# Altium schematic sheet GSM.SchDoc: GSM
size A4; SheetNumber: 1; SheetTotal: 1
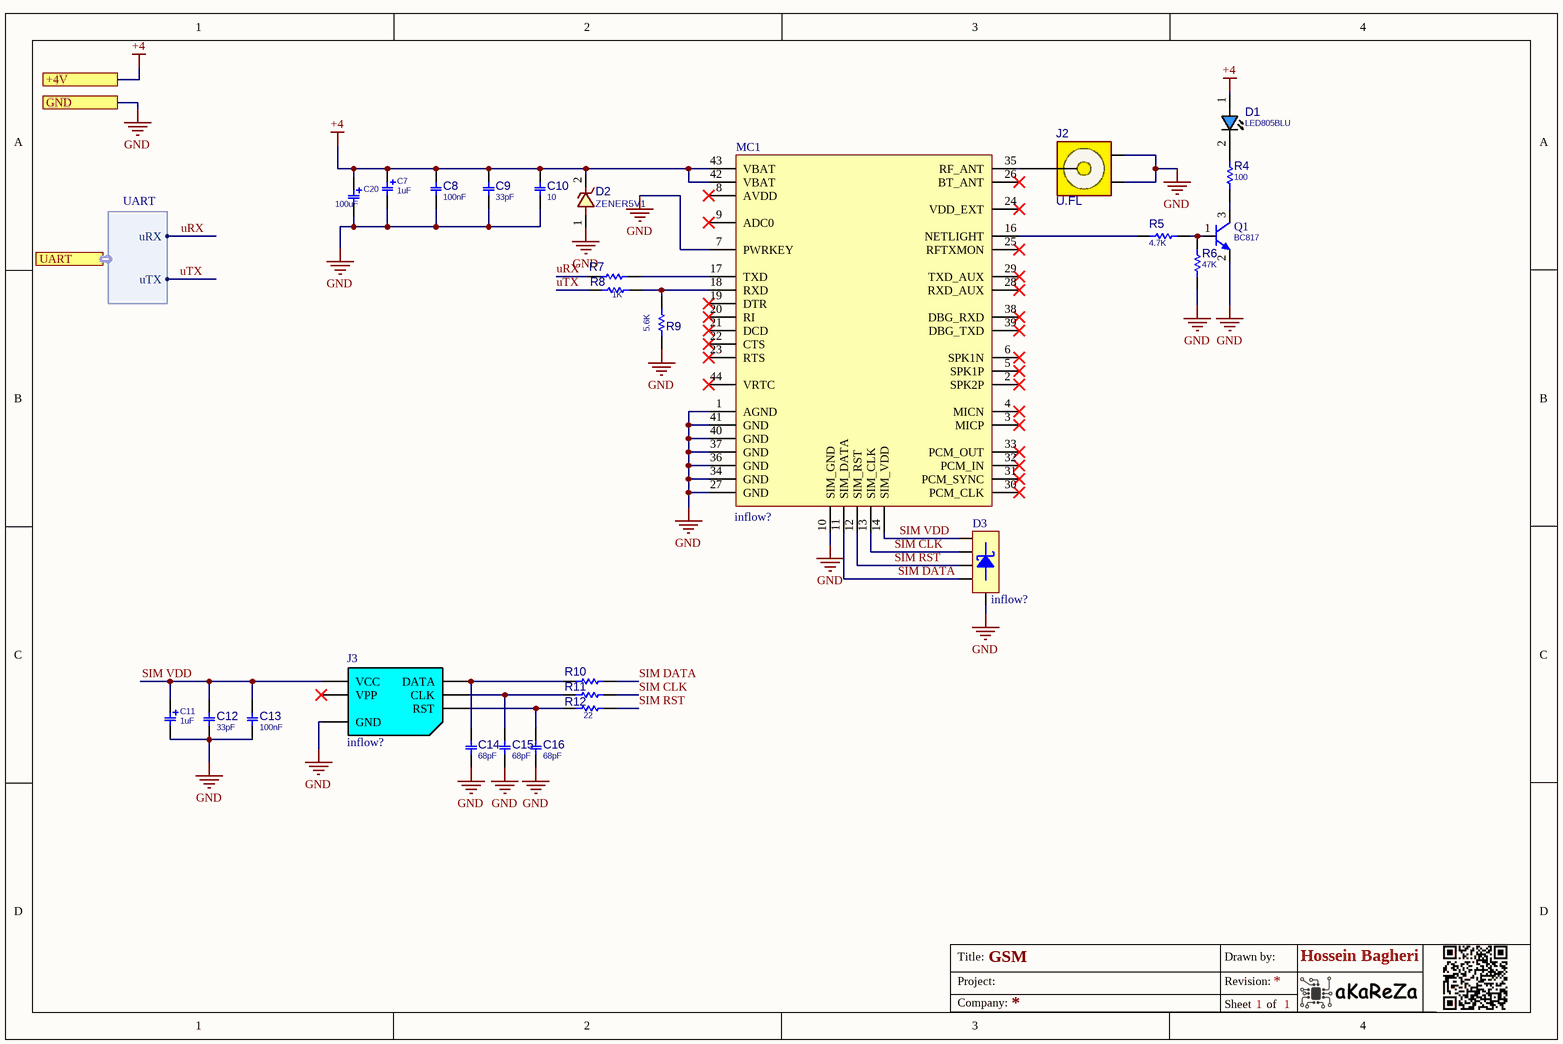
[diagram p0: GSM.SchDoc]

## Parts
C7  1uF  [C_TN_2012]
C8  100nF  [C0805]
C9  33pF  [C0805]
C10  10  [C0805]
C11  1uF  [C_TN_2012]
C12  33pF  [C0805]
C13  100nF  [C0805]
C14  68pF  [C0805]
C15  68pF  [C0805]
C16  68pF  [C0805]
C20  100uF  [C_TN_3528]
D1  LED805BLU  [LED0805BLU]
D2  ZENER5V1  [D_SOD123W]
D3  Inflow: inflow?  [SC70-5_N]  (hidden comment: SMF-05)
J2  U.FL  [UFL]
J3  Inflow: inflow?  [GCT_SIM8051]  (hidden comment: 6'Pin)
MC1  Inflow: inflow?  [m66]  (hidden comment: M66)
Q1  BC817  [SOT23_3]
R4  100  [R0805]
R5  4.7K  [R0805]
R6  47K  [R0805]
R7  1K  [R0805]
R8  22  [R0805]  (value not drawn)
R9  5.6K  [R0805]
R10  22  [R0805]  (value not drawn)
R11  22  [R0805]  (value not drawn)
R12  22  [R0805]

## Ports
+4V, GND, UART (harness UART)

## Harnesses
UART: uRX, uTX

## Nets
+4: C7.1 C8.2 C9.2 C10.2 C20.1 D1.1(ANODE) D2.2 MC1.42(VBAT) MC1.43(VBAT) ; port +4V
GND: C7.2 C8.1 C9.1 C10.1 C11.2 C12.1 C13.1 C14.1 C15.1 C16.1 C20.2 D2.1 D3.2(K) J2.2(G1) J2.3(G2) J3.5(GND) MC1.1(AGND) MC1.7(PWRKEY) MC1.10(SIM_GND) MC1.27(GND) MC1.34(GND) MC1.36(GND) MC1.37(GND) MC1.40(GND) MC1.41(GND) Q1.2(E) R6.1 R9.2 ; port GND
SIM CLK: D3.4(K) MC1.13(SIM_CLK) R11.1
SIM DATA: D3.5(K) MC1.11(SIM_DATA) R10.1
SIM RST: D3.1(K) MC1.12(SIM_RST) R12.1
SIM VDD: C11.1 C12.2 C13.2 D3.3(K) J3.1(VCC) MC1.14(SIM_VDD)
uRX: R7.2 ; port UART.uRX
uTX: R8.2 ; port UART.uTX
NetC14_2: C14.2 J3.4(DATA) R10.2
NetC15_2: C15.2 J3.3(CLK) R11.2
NetC16_2: C16.2 J3.2(RST) R12.2
NetD1_2: D1.2(CATHODE) R4.2
NetJ2_1: J2.1(SIG) MC1.35(RF_ANT)
NetMC1_16: MC1.16(NETLIGHT) R5.2
NetMC1_17: MC1.17(TXD) R7.1
NetMC1_18: MC1.18(RXD) R8.1 R9.1
NetQ1_1: Q1.1(B) R5.1 R6.2
NetQ1_3: Q1.3(C) R4.1

Not connected (* = marked no-connect by the designer): J3 6(VPP)*; MC1 2(SPK2P)* 3(MICP)* 4(MICN)* 5(SPK1P)* 6(SPK1N)* 8(AVDD)* 9(ADC0)* 19(DTR)* 20(RI)* 21(DCD)* 22(CTS)* 23(RTS)* 24(VDD_EXT)* 25(RFTXMON)* 26(BT_ANT)* 28(RXD_AUX)* 29(TXD_AUX)* 30(PCM_CLK)* 31(PCM_SYNC)* 32(PCM_IN)* 33(PCM_OUT)* 38(DBG_RXD)* 39(DBG_TXD)* 44(VRTC)*

## Notes on the sheet
- Title:
- Project:
- Drawn by:
- Revision:
- Hossein Bagheri
- Company:
- Sheet
- of

## Library data of the parts
C7 C11 = CAP_SMD_TAN: CAP, SMD, TAN,; PARAM2: 6.3V; VALUE: 1uF
C8-C10 C12-C16 = CAP_SMD_MLCC_2.2u50V_0805: CAP, MLCC; MANF_P#: UMK212ABJ225KG-T; MANF: Taiyo Yuden; PARAM: X5R, 10%; DIST#: MOUSER; PARAM2: 50V; ASSEMBLY: ASSEMBLY; PRICE: 100= 10$; DESC: CAP, MLCC
  C8 C13: VALUE: 100nF
  C9 C12: VALUE: 33pF
  C10: VALUE: 10
  C14-C16: VALUE: 68pF
C20 = CAP_SMD_TAN_10uF_16V: CAP, SMD, TAN; PARAM: 20%, 200mOhm, -55~105oC; MANF: AVX; MANF_P#: TCJT106M016R0200; PARAM2: 25V; PRICE: 1$; VALUE: 100uF
D1 = LED_SMD_0805_BLU: LED, SMD, 0805, BLUE; DESC: DESCRIPTION; MANF_P#: MANF_PART#; PARAM2: 2.2V; MANF: MANF; ASSEMBLY: ASSEMBLY; PRICE: 36t@Javan; VALUE: LED805BLU
D2 = DIODE_SMD_ZENER_BZT52HC5V1: DIODE, ZENER, 1W, 5.1V; MANF: Diodes; DESC: DESCRIPTION; PARAM2: 1W, 4Ohm, -55~150oC; MANF_P#: BZT52HC5V1WF-7; ASSEMBLY: ASSEMBLY; PRICE: 0.25$; PARAM: 5.1V; VALUE: ZENER5V1
D3 = Semi_Diod_TVS_SMF05: TVS Diode Array; Rating: Rating?; Validation: Valid; Type: TVS; Value: SMF-05; Package: SC70-5
J2 = CONN_RF_UFL: CONN, RF, U.FL, STRAIGHT, Ultra Miniature Coaxial; MANF_P#: CONUFL001-SMD, U.FL-R-SMT-1(10), 128-0711-201; MANF: Linx, Hirose, Cinch; PARAM: 50Ohm, 6GHz; DESC: DESCRIPTION; DIST#: DIGIKEY, MOUSER; PARAM2: GOLD; ASSEMBLY: ASSEMBLY; PRICE: 0.9$; VALUE: U.FL
J3 = Con_Socket_SimCard_1: Nano SimCard Holder 6P; Rating: Rating?; Validation: Valid; Package: SMD; Type: Nano; Value: 6'Pin
MC1 = ModSen_Com_M66: Quectel GSM/GPRS Module; Rating: Rating?; Validation: Valid; Package: Dip; Value: M66; Type: GSM-GPRS
Q1 = NPN_BC817_SOT23: BJT, NPN, 45v, 0.5A, SMD, SOT23; PARAM: 0.5A, Hfe100~600; PARAM2: 45v, 250mW; MANF: NXP, ON; MANF_P#: BC817; VALUE: BC817
R4-R12 = RES_SMD_0805: RESISTOR, SMD; PARAM: -W; DESC: DESCRIPTION; DIST#: MOUSER; PARAM2: 1%; MANF_P#: -; MANF: -; ASSEMBLY: ASSEMBLY; PRICE: 100= 0.5$
  R4: VALUE: 100
  R5: VALUE: 4.7K
  R6: VALUE: 47K
  R7: VALUE: 1K
  R8 R10-R12: VALUE: 22
  R9: VALUE: 5.6K